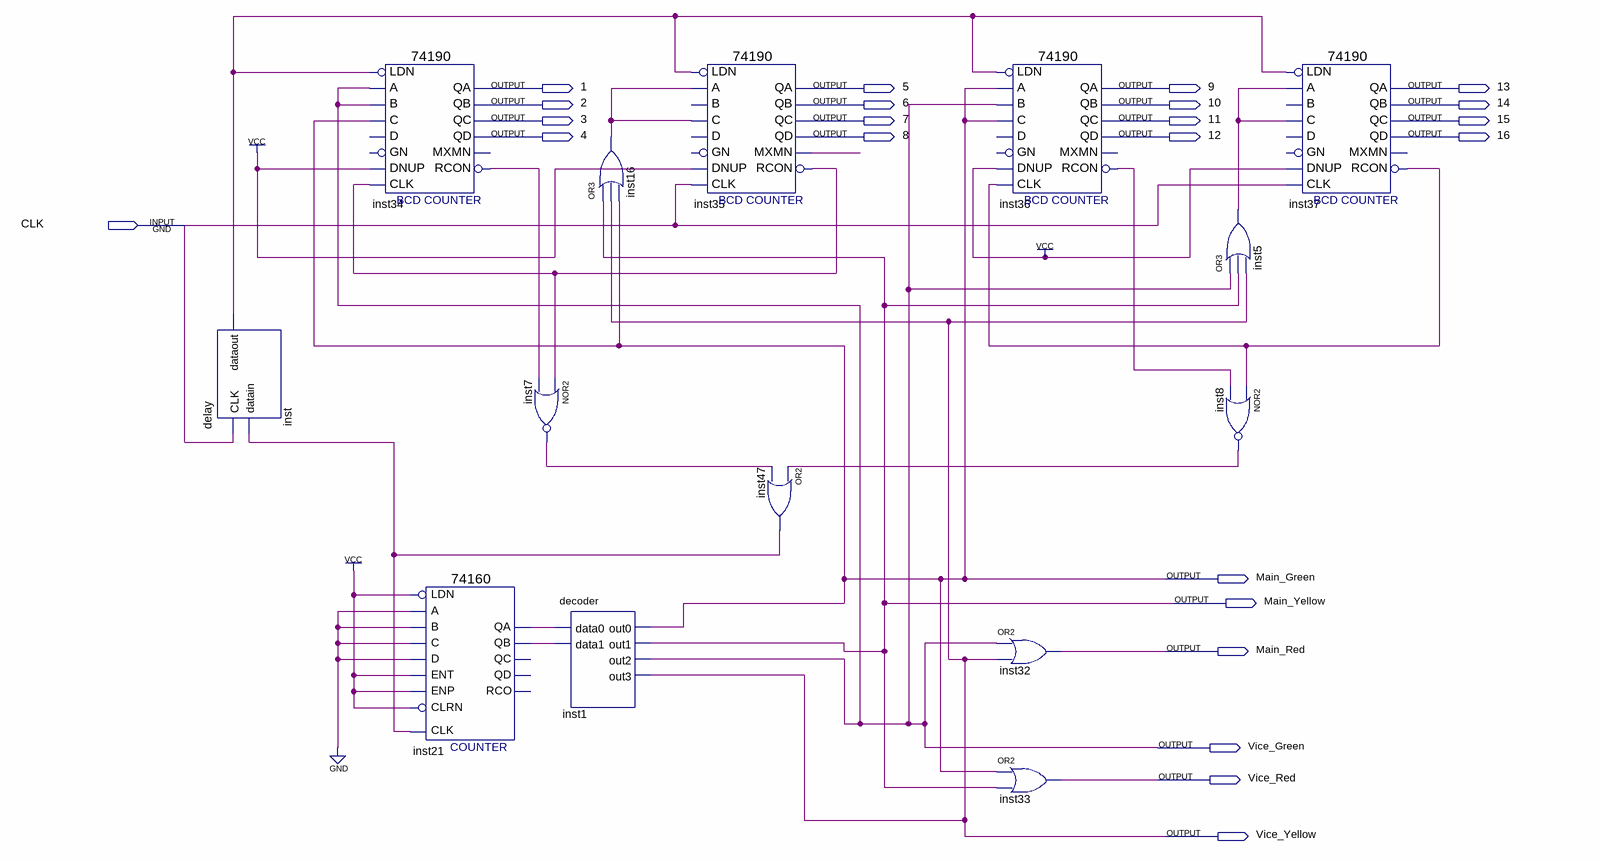
[diagram p0: schematic sheet]
// Quartus schematic TrafficLight.bdf as structural Verilog: 14 symbols, 23 pins
module TrafficLight (
  input  CLK,
  output \1 ,
  output \5 ,
  output \9 ,
  output \13 ,
  output \2 ,
  output \6 ,
  output \10 ,
  output \14 ,
  output \3 ,
  output \7 ,
  output \11 ,
  output \15 ,
  output \4 ,
  output \8 ,
  output \12 ,
  output \16 ,
  output Main_Green,
  output Main_Yellow,
  output Main_Red,
  output Vice_Green,
  output Vice_Red,
  output Vice_Yellow
);

  wire inst5_out, inst7_out, inst8_out, inst16_out, inst21_qa, inst21_qb, inst34_rcon, inst35_mxmn,
       inst35_rcon, inst36_rcon, inst37_rcon, inst47_out, inst_dataout;

  delay inst (.CLK(CLK), .datain(inst47_out), .dataout(inst_dataout));
  \74190  inst34 (
    .LDN(inst_dataout), .A(Vice_Green), .C(Main_Green), .B(Vice_Green), .CLK(inst35_rcon), .DNUP(1'b1),
    .QA(\1 ), .QB(\2 ), .QD(\4 ), .QC(\3 ), .RCON(inst34_rcon));  // open: D, GN, MXMN
  \74160  inst21 (
    .CLK(inst47_out), .ENT(1'b1), .A(1'b0), .B(1'b0), .C(1'b0), .D(1'b0), .LDN(1'b1), .ENP(1'b1),
    .CLRN(1'b1), .QA(inst21_qa), .QB(inst21_qb));  // open: QD, QC, RCO
  nor inst7 (inst7_out, inst35_rcon, inst34_rcon);
  or inst16 (inst16_out, Main_Yellow, Vice_Yellow, Main_Green);
  decoder inst1 (
    .data0(inst21_qa), .data1(inst21_qb), .out0(Main_Green), .out1(Main_Yellow), .out2(Vice_Green),
    .out3(Vice_Yellow));
  \74190  inst35 (
    .LDN(inst_dataout), .A(inst16_out), .C(inst16_out), .CLK(CLK), .DNUP(1'b1), .QA(\5 ), .QB(\6 ), .QD(\8 ),
    .QC(\7 ), .MXMN(inst35_mxmn), .RCON(inst35_rcon));  // open: B, D, GN
  or inst47 (inst47_out, inst8_out, inst7_out);
  \74190  inst36 (
    .LDN(inst_dataout), .A(Main_Green), .C(Main_Green), .B(Vice_Green), .CLK(inst37_rcon), .DNUP(1'b1),
    .QA(\9 ), .QB(\10 ), .QD(\12 ), .QC(\11 ), .RCON(inst36_rcon));  // open: D, GN, MXMN
  or inst32 (Main_Red, Vice_Green, Vice_Yellow);
  or inst33 (Vice_Red, Main_Green, Main_Yellow);
  or inst5 (inst5_out, Vice_Green, Main_Yellow, Vice_Yellow);
  nor inst8 (inst8_out, inst37_rcon, inst36_rcon);
  \74190  inst37 (
    .LDN(inst_dataout), .A(inst5_out), .C(inst5_out), .CLK(CLK), .DNUP(1'b1), .QA(\13 ), .QB(\14 ),
    .QD(\16 ), .QC(\15 ), .RCON(inst37_rcon));  // open: B, D, GN, MXMN
endmodule
